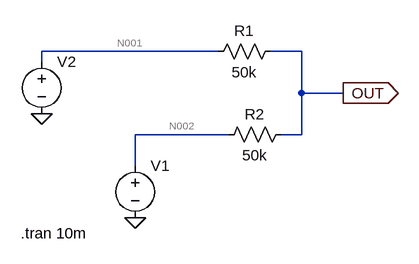
[diagram p0: schematic Voltage_summer2.asc]
Voltage_summer2.asc, the LTspice schematic file:
Version 4
SHEET 1 880 680
WIRE 144 112 -128 112
WIRE 272 112 224 112
WIRE -128 128 -128 112
WIRE 272 176 272 112
WIRE 336 176 272 176
WIRE 160 240 16 240
WIRE 272 240 272 176
WIRE 272 240 240 240
WIRE 16 288 16 240
FLAG -128 208 0
FLAG 16 368 0
FLAG 336 176 OUT
IOPIN 336 176 Out
SYMBOL res 240 96 R90
WINDOW 0 0 56 VBottom 2
WINDOW 3 32 56 VTop 2
SYMATTR InstName R1
SYMATTR Value 50k
SYMBOL res 256 224 R90
WINDOW 0 0 56 VBottom 2
WINDOW 3 32 56 VTop 2
SYMATTR InstName R2
SYMATTR Value 50k
SYMBOL voltage 16 272 R0
WINDOW 3 24 96 Invisible 2
WINDOW 123 0 0 Left 0
WINDOW 39 0 0 Left 0
SYMATTR Value SINE(0.5 0.5 5k)
SYMATTR InstName V1
SYMBOL voltage -128 112 R0
WINDOW 3 24 96 Invisible 2
WINDOW 123 0 0 Left 0
WINDOW 39 0 0 Left 0
SYMATTR Value PULSE(0 1 0 0.000001u 0.000001u 0.5m 1m)
SYMATTR InstName V2
TEXT -160 392 Left 2 !.tran 10m

The netlist it stands for:
* Voltage_summer2.asc
R1 OUT N001 50k
R2 OUT N002 50k
V1 N002 0 SINE(0.5 0.5 5k)
V2 N001 0 PULSE(0 1 0 0.000001u 0.000001u 0.5m 1m)
.tran 10m
.backanno
.end

* Results of the author's LTspice run, read from the files saved beside the schematic
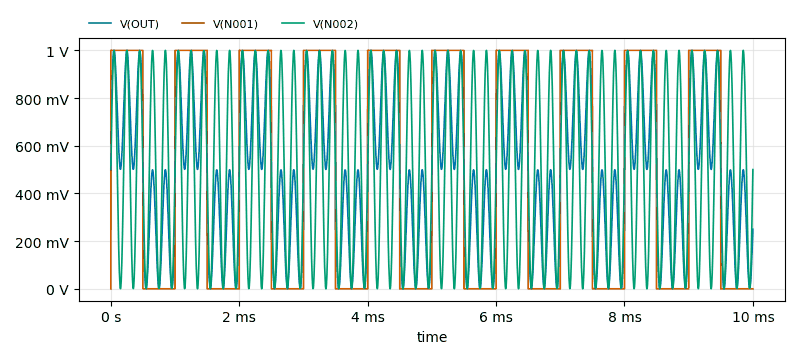
[diagram p1: Transient Analysis of Voltage_summer2.asc, plotted from the saved traces]
* Transient Analysis, 1 run:
*   V(OUT): min 789.2 µV, max 999.3 mV, average 500 mV, rms 599 mV, last 250 mV
*   V(N001): min -227.9 nV, max 1 V, average 500 mV, rms 707.1 mV, last 0 V
*   V(N002): min 10.45 µV, max 1 V, average 500 mV, rms 613.3 mV, last 500 mV